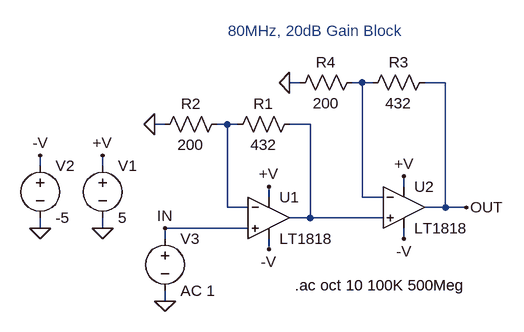
[diagram p0: schematic 1818.asc]
1818.asc, the LTspice schematic file:
Version 4
SHEET 1 896 680
WIRE 240 32 224 32
WIRE 336 32 320 32
WIRE 352 32 336 32
WIRE 464 32 432 32
WIRE 32 96 16 96
WIRE 128 96 112 96
WIRE 144 96 128 96
WIRE 256 96 224 96
WIRE -160 160 -160 144
WIRE -64 160 -64 144
WIRE 400 192 400 176
WIRE 192 208 192 192
WIRE 336 208 336 32
WIRE 368 208 336 208
WIRE 128 224 128 96
WIRE 160 224 128 224
WIRE 464 224 464 32
WIRE 464 224 432 224
WIRE 496 224 464 224
WIRE 256 240 256 96
WIRE 256 240 224 240
WIRE 368 240 256 240
WIRE -160 256 -160 240
WIRE -64 256 -64 240
WIRE 160 256 32 256
WIRE 32 272 32 256
WIRE 400 272 400 256
WIRE 192 288 192 272
WIRE 32 368 32 352
FLAG -64 256 0
FLAG 192 192 +V
FLAG -64 144 +V
FLAG 192 288 -V
FLAG -160 256 0
FLAG -160 144 -V
FLAG 16 96 0
FLAG 32 368 0
FLAG 400 176 +V
FLAG 400 272 -V
FLAG 224 32 0
FLAG 496 224 OUT
FLAG 32 256 IN
SYMBOL voltage -64 144 R0
SYMATTR InstName V1
SYMATTR Value 5
SYMBOL voltage -160 144 R0
SYMATTR InstName V2
SYMATTR Value -5
SYMBOL res 240 80 R90
WINDOW 0 0 56 VBottom 2
WINDOW 3 32 56 VTop 2
SYMATTR InstName R1
SYMATTR Value 432
SYMBOL res 128 80 R90
WINDOW 0 0 56 VBottom 2
WINDOW 3 32 56 VTop 2
SYMATTR InstName R2
SYMATTR Value 200
SYMBOL voltage 32 256 R0
SYMATTR InstName V3
SYMATTR Value AC 1
SYMBOL opamps\\LT1818 192 240 R0
SYMATTR InstName U1
SYMBOL res 448 16 R90
WINDOW 0 0 56 VBottom 2
WINDOW 3 32 56 VTop 2
SYMATTR InstName R3
SYMATTR Value 432
SYMBOL res 336 16 R90
WINDOW 0 0 56 VBottom 2
WINDOW 3 32 56 VTop 2
SYMATTR InstName R4
SYMATTR Value 200
SYMBOL opamps\\LT1818 400 224 R0
SYMATTR InstName U2
TEXT 232 344 Left 2 !.ac oct 10 100K 500Meg
TEXT 264 -32 Bottom 2 ;80MHz, 20dB Gain Block

The netlist it stands for:
* 1818.asc
V1 +V 0 5
V2 -V 0 -5
R1 N003 N002 432
R2 N002 0 200
V3 IN 0 AC 1
XU1 IN N002 N003 +V -V LT1818  ; pins In+ In- OUT V+ V-
R3 OUT N001 432
R4 N001 0 200
XU2 N003 N001 OUT +V -V LT1818  ; pins In+ In- OUT V+ V-
.ac oct 10 100K 500Meg
* 80MHz, 20dB Gain Block
.lib LTC2.lib
.backanno
.end